# Altium schematic sheet LCboardRev2.SchDoc
size Letter
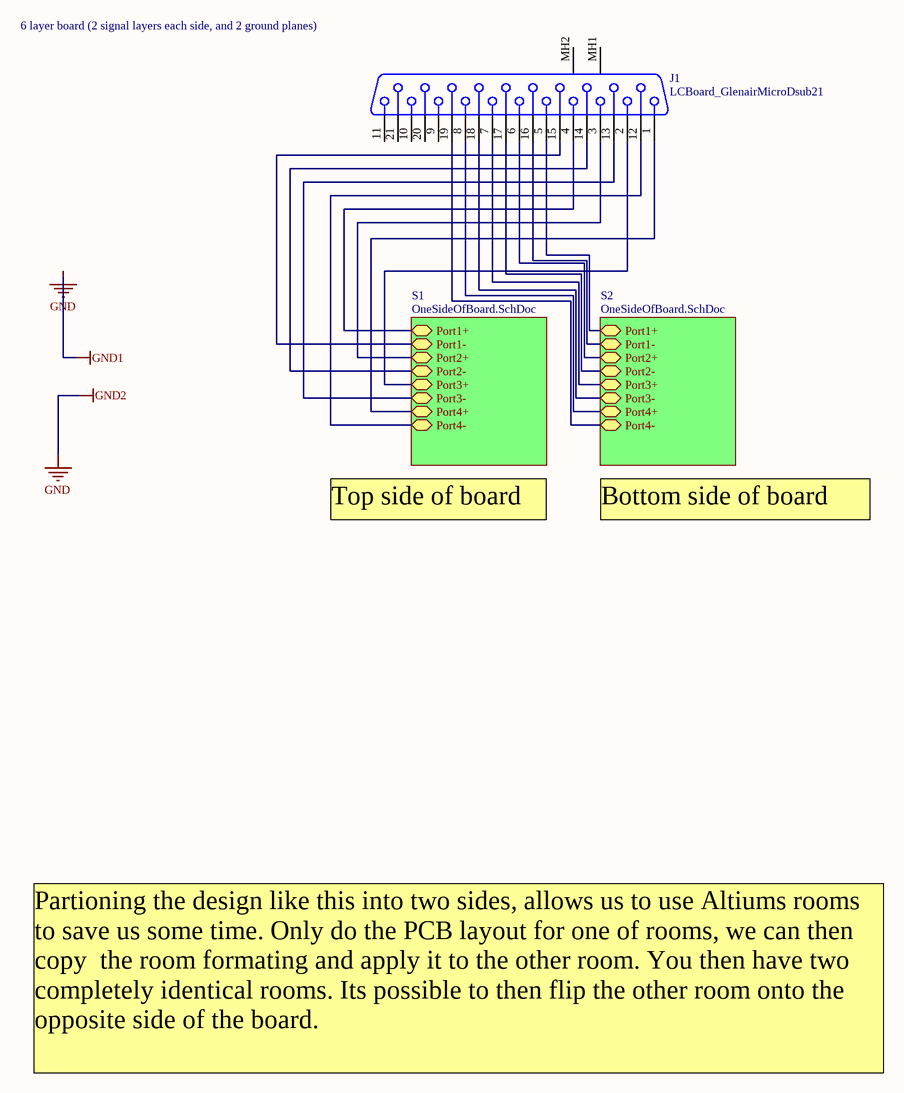
[diagram p0: LCboardRev2.SchDoc]

## Parts
J1  LCBoard_GlenairMicroDsub21  [MicroD-MWDM2L-21SCBRP-.110]

## Sub-sheets
S1 = OneSideOfBoard.SchDoc: Port1+, Port1-, Port2+, Port2-, Port3+, Port3-, Port4+, Port4-
S2 = OneSideOfBoard.SchDoc: Port1+, Port1-, Port2+, Port2-, Port3+, Port3-, Port4+, Port4-

## Nets
NetJ1_1: J1.1 ; sheet S1/Port4+
NetJ1_2: J1.2 ; sheet S1/Port3+
NetJ1_3: J1.3 ; sheet S1/Port2+
NetJ1_4: J1.4 ; sheet S1/Port1+
NetJ1_5: J1.5 ; sheet S2/Port1+
NetJ1_6: J1.6 ; sheet S2/Port2+
NetJ1_7: J1.7 ; sheet S2/Port3+
NetJ1_8: J1.8 ; sheet S2/Port4+
NetJ1_12: J1.12 ; sheet S1/Port4-
NetJ1_13: J1.13 ; sheet S1/Port3-
NetJ1_14: J1.14 ; sheet S1/Port2-
NetJ1_15: J1.15 ; sheet S1/Port1-
NetJ1_16: J1.16 ; sheet S2/Port1-
NetJ1_17: J1.17 ; sheet S2/Port2-
NetJ1_18: J1.18 ; sheet S2/Port3-
NetJ1_19: J1.19 ; sheet S2/Port4-

Not connected (* = marked no-connect by the designer): J1 9 10 11 20 21 MH1 MH2

## Notes on the sheet
- (near J1) 6 layer board (2 signal layers each side, and 2 ground planes)
- Top side of board
- Bottom side of board
- Partioning the design like this into two sides, allows us to use Altiums rooms to save us some time. Only do the PCB layout for one of rooms, we can then copy  the room formating and apply it to the other room. You then have two completely identical rooms. Its possible to then flip the other room onto the opposite side of the board.
- Labels drawn without touching a wire or pin: GND

## Library data of the parts
J1 = LCBoard_GlenairMicroDsub21: PackageDescription: Connector; D-Sub, Thru-Hole; 9 Position; Vertical; Body 30.81 x 9.60 x 8.20 mm (LxWxH)